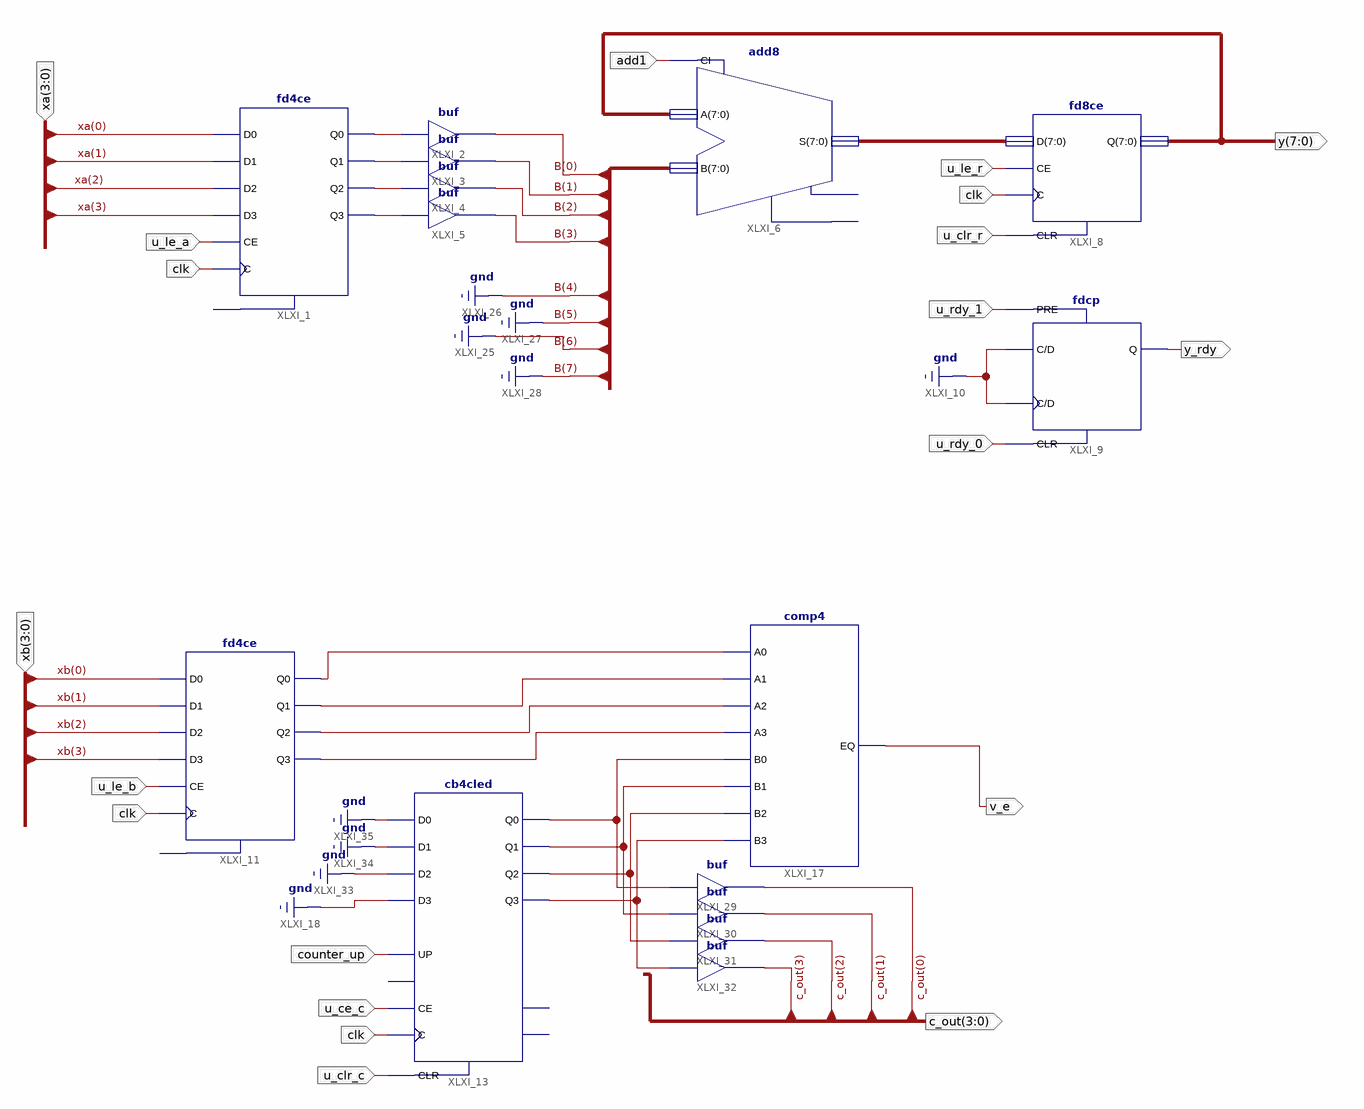
[diagram p0: schematic sheet 1]
// Xilinx ISE schematic Schematic_task1_2.sch (spartan3a) as structural Verilog: 15 symbols, 17 ports
module Schematic_task1_2 (
  input  [3:0] xa,
  input  clk,
  input  u_le_a,
  input  u_clr_r,
  input  add1,
  input  u_rdy_1,
  input  u_rdy_0,
  input  [3:0] xb,
  input  counter_up,
  input  u_clr_c,
  input  u_ce_c,
  input  u_le_b,
  input  u_le_r,
  output [7:0] y,
  output y_rdy,
  output v_e,
  output [3:0] c_out
);

  wire XLXN_31, XLXN_32, XLXN_33, XLXN_34, XLXN_96, XLXN_97, XLXN_100, XLXN_101, XLXN_171, XLXN_172,
       XLXN_173, XLXN_174;
  wire [3:0] B;
  wire [7:0] XLXN_75;

  fd4ce XLXI_1 (
    .C(clk), .CE(u_le_a), .D0(xa[0]), .D1(xa[1]), .D2(xa[2]), .D3(xa[3]), .Q0(XLXN_31), .Q1(XLXN_32),
    .Q2(XLXN_33), .Q3(XLXN_34));  // open: CLR
  buf XLXI_2 (B[0], XLXN_31);
  buf XLXI_3 (B[1], XLXN_32);
  buf XLXI_4 (B[2], XLXN_33);
  buf XLXI_5 (B[3], XLXN_34);
  add8 XLXI_6 (.A(y), .B({4'b0000, B}), .CI(add1), .S(XLXN_75));  // open: CO, OFL
  fd8ce XLXI_8 (.C(clk), .CE(u_le_r), .CLR(u_clr_r), .D(XLXN_75), .Q(y));
  fdcp XLXI_9 (.C(1'b0), .CLR(u_rdy_0), .D(1'b0), .PRE(u_rdy_1), .Q(y_rdy));
  fd4ce XLXI_11 (
    .C(clk), .CE(u_le_b), .D0(xb[0]), .D1(xb[1]), .D2(xb[2]), .D3(xb[3]), .Q0(XLXN_96), .Q1(XLXN_100),
    .Q2(XLXN_101), .Q3(XLXN_97));  // open: CLR
  cb4cled XLXI_13 (
    .C(clk), .CE(u_ce_c), .CLR(u_clr_c), .D0(1'b0), .D1(1'b0), .D2(1'b0), .D3(1'b0), .UP(counter_up),
    .Q0(XLXN_174), .Q1(XLXN_173), .Q2(XLXN_172), .Q3(XLXN_171));  // open: L, CEO, TC
  comp4 XLXI_17 (
    .A0(XLXN_96), .A1(XLXN_100), .A2(XLXN_101), .A3(XLXN_97), .B0(XLXN_174), .B1(XLXN_173), .B2(XLXN_172),
    .B3(XLXN_171), .EQ(v_e));
  buf XLXI_29 (c_out[0], XLXN_174);
  buf XLXI_30 (c_out[1], XLXN_173);
  buf XLXI_31 (c_out[2], XLXN_172);
  buf XLXI_32 (c_out[3], XLXN_171);
endmodule
